# Altium schematic sheet summary.SchDoc
size A3; Hw_rev: R1; Author: Daniele Basile <asterix24@gmail.com>; Address3: Firenze; Address4: ITALY; Revision: 0; SheetNumber: 1; SheetTotal: 2
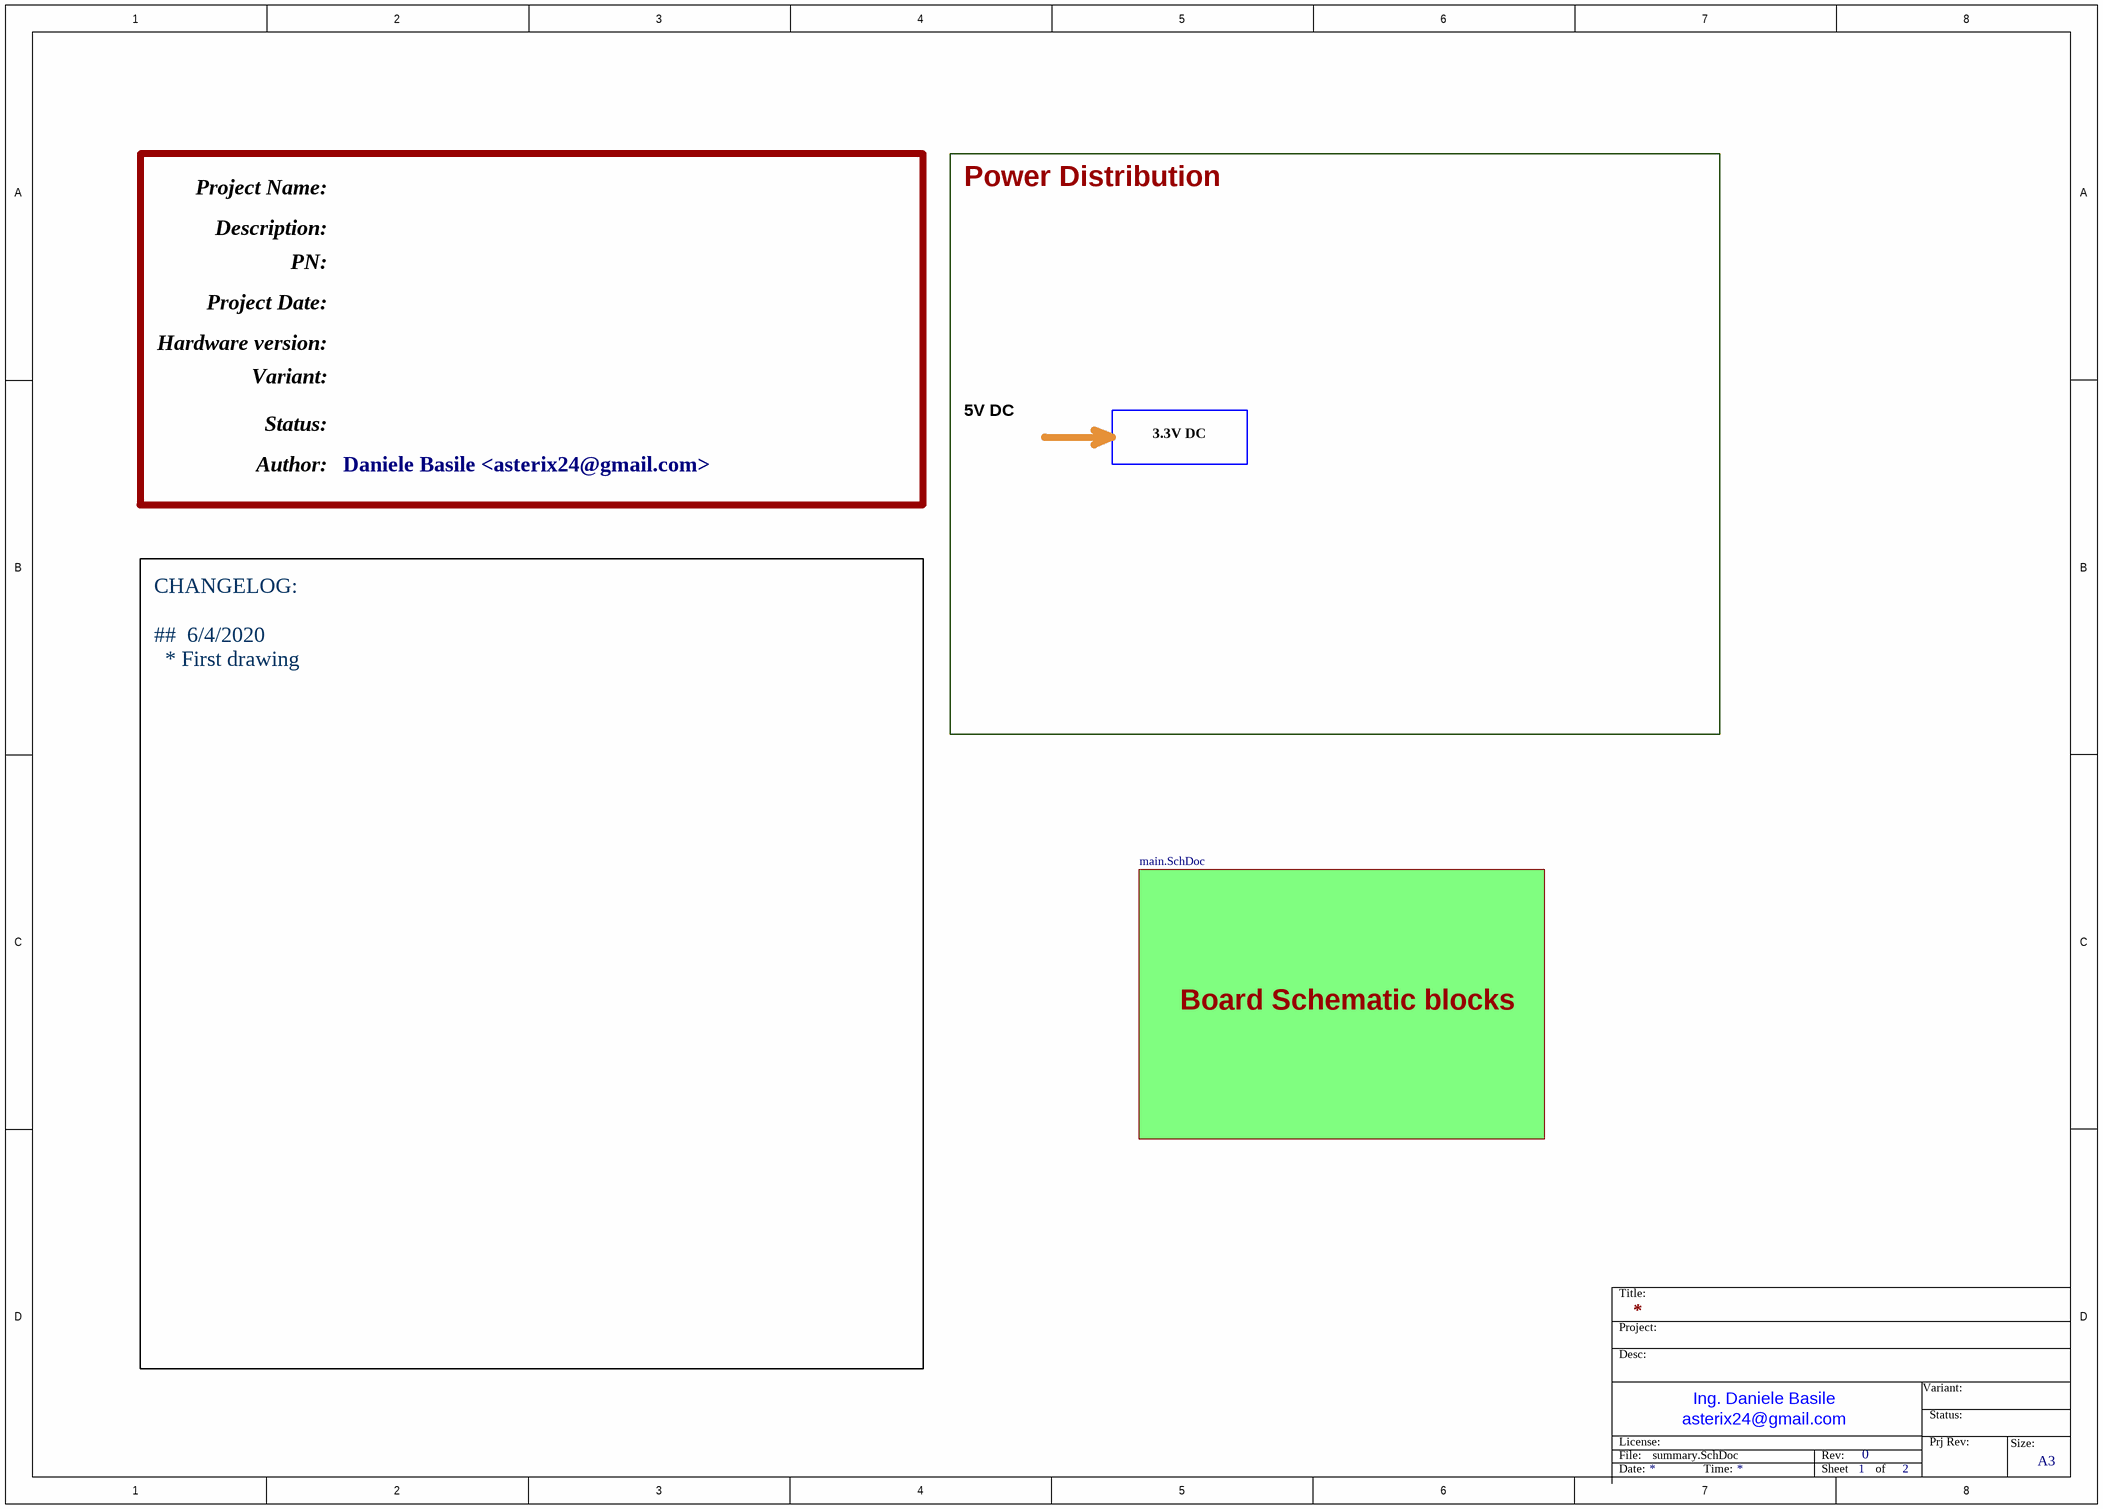
[diagram p0: summary.SchDoc]

## Sub-sheets
? = main.SchDoc: no entries

## Notes on the sheet
- Project Name:
- Description:
- Power Distribution
- Project Date:
- PN:
- Hardware version:
- Variant:
- Status:
- 5V DC
- Author:
- 3.3V DC
- Board Schematic blocks
- CHANGELOG:
  ##  6/4/2020
  * First drawing
- Title:
- Project:
- Desc:
- File:
- License:
- asterix24@gmail.com
- Ing. Daniele Basile
- Rev:
- Prj Rev:
- Size:
- Date:
- Time:
- Sheet
- of
- A3